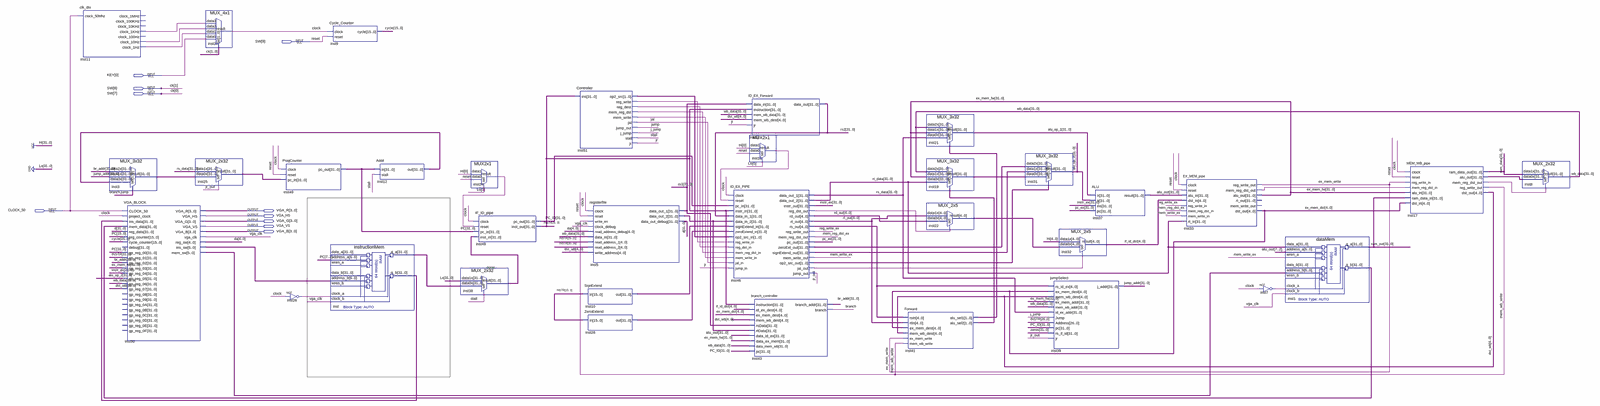
[diagram p0: schematic sheet, whole]
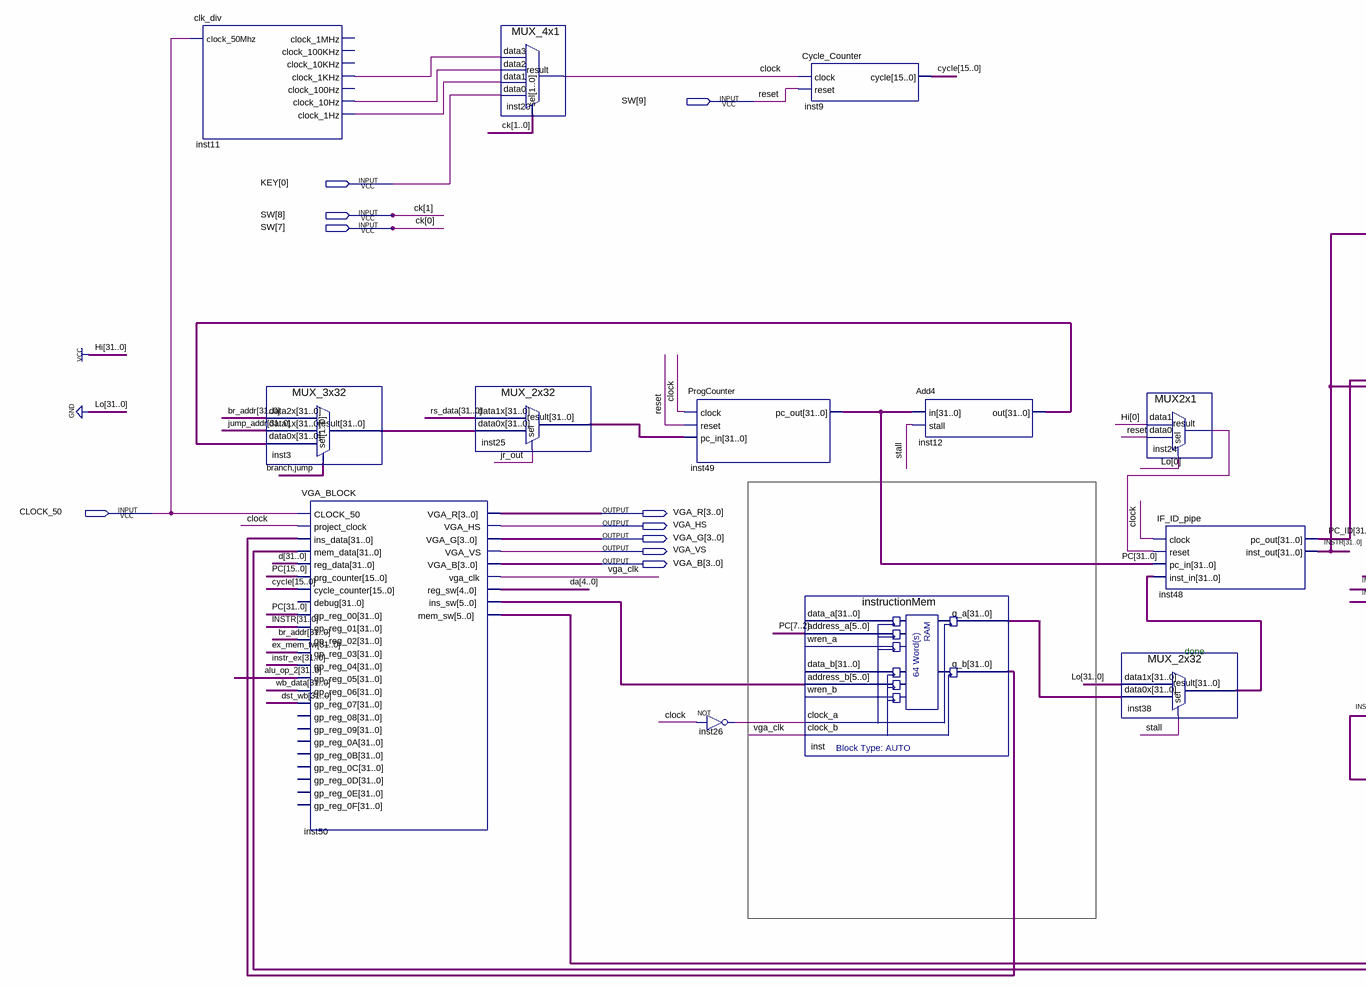
[diagram p1: schematic sheet, left part]
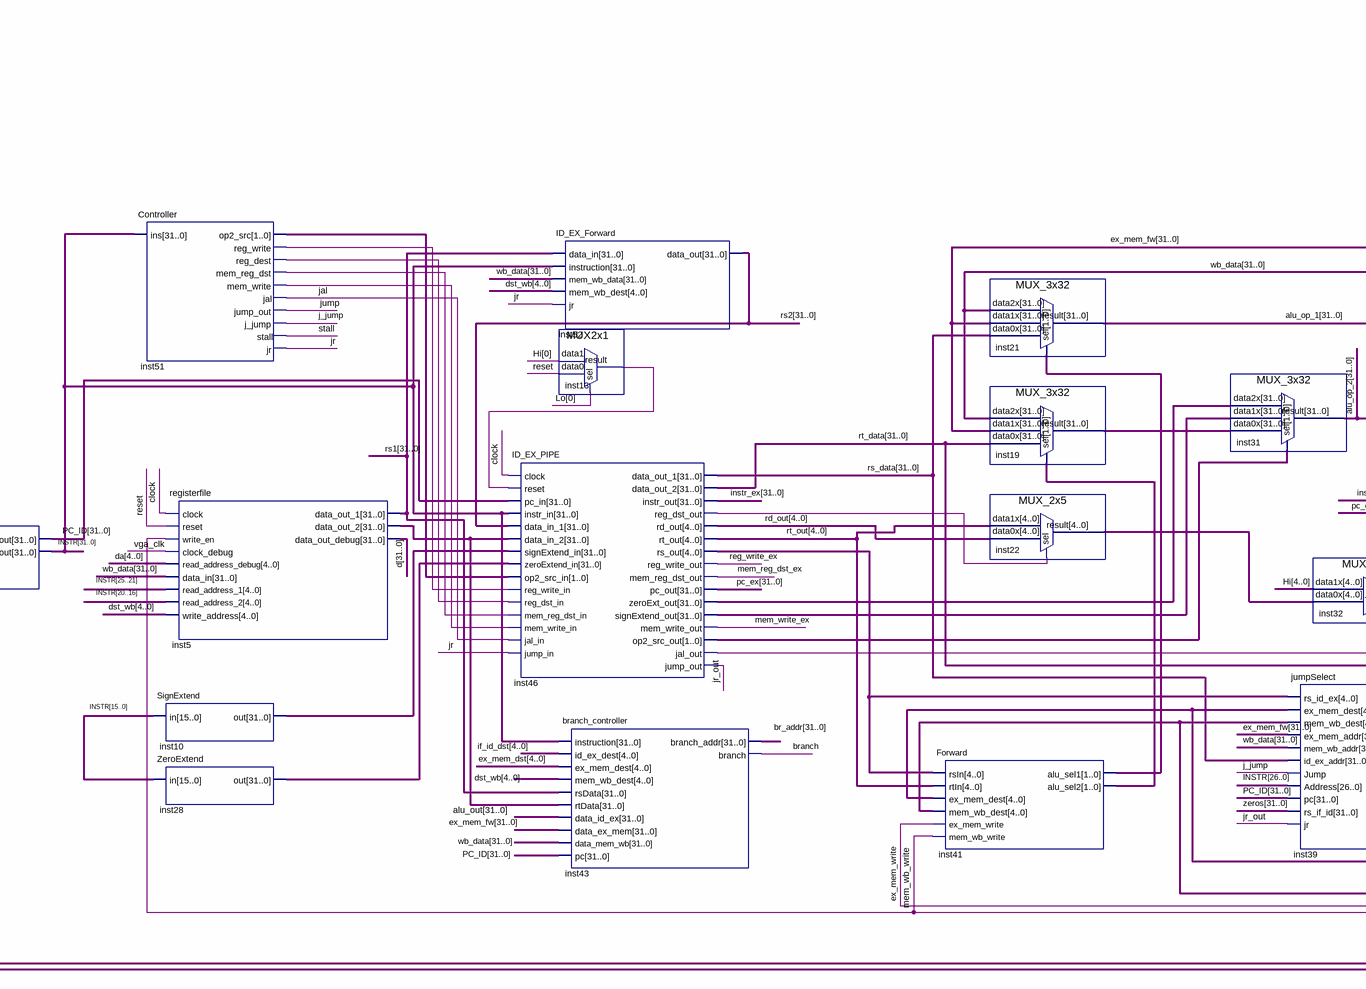
[diagram p2: schematic sheet, centre part]
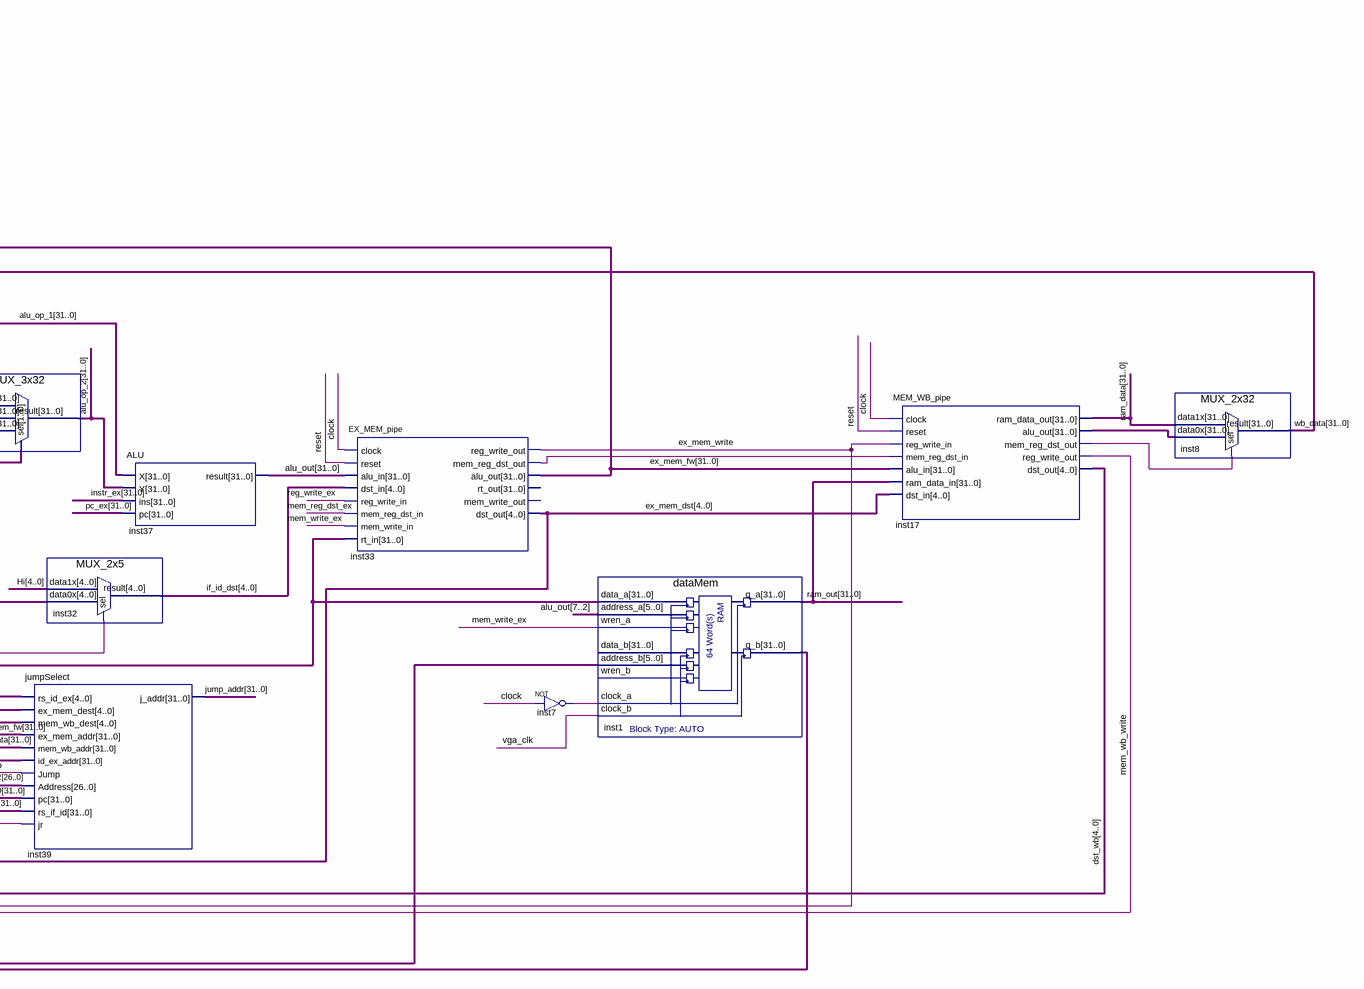
[diagram p3: schematic sheet, right part]
// Quartus schematic BetterMILESTONE4.bdf as structural Verilog: 34 symbols, 10 pins
module BetterMILESTONE4 (
  input  [9:7] SW,
  input  [0:0] KEY,
  input  CLOCK_50,
  output [3:0] VGA_R,
  output VGA_HS,
  output [3:0] VGA_G,
  output VGA_VS,
  output [3:0] VGA_B
);

  wire branch, clock, ex_mem_write, inst7_out, inst11_clock_1hz, inst11_clock_1khz, inst11_clock_10hz,
       inst13_result, inst17_mem_reg_dst_out, inst24_result, inst26_out, inst33_mem_reg_dst_out,
       inst46_jal_out, inst46_reg_dst_out, inst51_mem_reg_dst, inst51_mem_write, inst51_reg_dest,
       inst51_reg_write, j_jump, jal, jr, jr_out, jump, mem_reg_dst_ex, mem_wb_write, mem_write_ex,
       reg_write_ex, stall, vga_clk;
  wire [1:0] inst41_alu_sel1, inst41_alu_sel2, inst46_op2_src_out, inst51_op2_src;
  wire [4:0] da, ex_mem_dst, if_id_dst, inst22_result, inst46_rs_out, rd_out, rt_out;
  wire [5:0] inst50_ins_sw, inst50_mem_sw;
  wire [15:0] cycle;
  wire [31:0] alu_op_1, alu_op_2, alu_out, br_addr, d, dst_wb, ex_mem_fw, inst1_q_b, inst3_result,
       inst5_data_out_2, inst10_out, inst12_out, inst17_alu_out, inst19_result, inst25_result, inst28_out,
       inst38_result, inst46_signextend_out, inst46_zeroext_out, inst_q_a, inst_q_b, INSTR, instr_ex,
       jump_addr, PC, pc_ex, PC_ID, ram_data, ram_out, rs1, rs2, rs_data, rt_data, wb_data, zeros;

  clk_div inst11 (
    .clock_50Mhz(CLOCK_50), .clock_1KHz(inst11_clock_1khz), .clock_10Hz(inst11_clock_10hz),
    .clock_1Hz(inst11_clock_1hz));  // open: clock_1MHz, clock_100KHz, clock_10KHz, clock_100Hz
  MUX_3x32 inst3 (
    .data2x(br_addr), .data1x(jump_addr), .data0x(inst12_out), .sel({branch, jump}), .result(inst3_result));
  VGA_BLOCK inst50 (
    .CLOCK_50(CLOCK_50), .project_clock(clock), .ins_data(inst_q_b), .mem_data(inst1_q_b), .reg_data(d),
    .prg_counter(PC[15:0]), .cycle_counter(cycle), .gp_reg_00(PC), .gp_reg_01(INSTR), .gp_reg_02(br_addr),
    .gp_reg_03(ex_mem_fw), .gp_reg_04(instr_ex), .gp_reg_05(alu_op_2), .gp_reg_06(wb_data),
    .gp_reg_07(dst_wb), .VGA_R(VGA_R), .VGA_HS(VGA_HS), .VGA_G(VGA_G), .VGA_VS(VGA_VS), .VGA_B(VGA_B),
    .vga_clk(vga_clk), .reg_sw(da), .ins_sw(inst50_ins_sw), .mem_sw(inst50_mem_sw));  // open: debug, gp_reg_08, gp_reg_09, gp_reg_0A, gp_reg_0B, gp_reg_0C, gp_reg_0D, gp_reg_0E, gp_reg_0F
  MUX_4x1 inst20 (
    .data3(inst11_clock_1khz), .data2(inst11_clock_10hz), .data1(inst11_clock_1hz), .data0(KEY[0]),
    .sel(SW[8:7]), .result(clock));
  MUX_2x32 inst25 (.data1x(rs_data), .data0x(inst3_result), .sel(jr_out), .result(inst25_result));
  ProgCounter inst49 (.clock(clock), .reset(SW[9]), .pc_in(inst25_result), .pc_out(PC));
  not inst26 (inst26_out, clock);
  Cycle_Counter inst9 (.clock(clock), .reset(SW[9]), .cycle(cycle));
  instructionMem inst (
    .address_a(PC[7:2]), .address_b(inst50_ins_sw), .clock_a(inst26_out), .clock_b(vga_clk), .q_a(inst_q_a),
    .q_b(inst_q_b));  // open: data_a, wren_a, data_b, wren_b
  Add4 inst12 (.in(PC), .stall(stall), .out(inst12_out));
  MUX_2x32 inst38 (.data1x({32{1'b0}}), .data0x(inst_q_a), .sel(stall), .result(inst38_result));
  MUX2x1 inst24 (.data1(1'b1), .data0(SW[9]), .sel(1'b0), .result(inst24_result));
  IF_ID_pipe inst48 (
    .clock(clock), .reset(inst24_result), .pc_in(PC), .inst_in(inst38_result), .pc_out(PC_ID),
    .inst_out(INSTR));
  Controller inst51 (
    .ins(INSTR), .op2_src(inst51_op2_src), .reg_write(inst51_reg_write), .reg_dest(inst51_reg_dest),
    .mem_reg_dst(inst51_mem_reg_dst), .mem_write(inst51_mem_write), .jal(jal), .jump_out(jump),
    .j_jump(j_jump), .stall(stall), .jr(jr));
  SignExtend inst10 (.in(INSTR[15:0]), .out(inst10_out));
  ZeroExtend inst28 (.in(INSTR[15:0]), .out(inst28_out));
  registerfile inst5 (
    .clock(clock), .reset(SW[9]), .write_en(mem_wb_write), .clock_debug(vga_clk), .read_address_debug(da),
    .data_in(wb_data), .read_address_1(INSTR[25:21]), .read_address_2(INSTR[20:16]),
    .write_address(dst_wb[4:0]), .data_out_1(rs1), .data_out_2(inst5_data_out_2), .data_out_debug(d));
  ID_EX_PIPE inst46 (
    .clock(clock), .reset(inst13_result), .pc_in(PC_ID), .instr_in(INSTR), .data_in_1(rs2),
    .data_in_2(inst5_data_out_2), .signExtend_in(inst10_out), .zeroExtend_in(inst28_out),
    .op2_src_in(inst51_op2_src), .reg_write_in(inst51_reg_write), .reg_dst_in(inst51_reg_dest),
    .mem_reg_dst_in(inst51_mem_reg_dst), .mem_write_in(inst51_mem_write), .jal_in(jal), .jump_in(jr),
    .data_out_1(rs_data), .data_out_2(rt_data), .instr_out(instr_ex), .reg_dst_out(inst46_reg_dst_out),
    .rd_out(rd_out), .rt_out(rt_out), .rs_out(inst46_rs_out), .reg_write_out(reg_write_ex),
    .mem_reg_dst_out(mem_reg_dst_ex), .pc_out(pc_ex), .zeroExt_out(inst46_zeroext_out),
    .signExtend_out(inst46_signextend_out), .mem_write_out(mem_write_ex), .op2_src_out(inst46_op2_src_out),
    .jal_out(inst46_jal_out), .jump_out(jr_out));
  ID_EX_Forward inst52 (
    .data_in(rs1), .instruction(INSTR), .mem_wb_data(wb_data), .mem_wb_dest(dst_wb[4:0]), .jr(jr),
    .data_out(rs2));
  MUX2x1 inst13 (.data1(1'b1), .data0(SW[9]), .sel(1'b0), .result(inst13_result));
  branch_controller inst43 (
    .instruction(INSTR), .id_ex_dest(if_id_dst), .ex_mem_dest(ex_mem_dst), .mem_wb_dest(dst_wb[4:0]),
    .rsData(rs1), .rtData(inst5_data_out_2), .data_id_ex(alu_out), .data_ex_mem(ex_mem_fw),
    .data_mem_wb(wb_data), .pc(PC_ID), .branch_addr(br_addr), .branch(branch));
  Forward inst41 (
    .rsIn(inst46_rs_out), .rtIn(rt_out), .ex_mem_dest(ex_mem_dst), .mem_wb_dest(dst_wb[4:0]),
    .ex_mem_write(ex_mem_write), .mem_wb_write(mem_wb_write), .alu_sel1(inst41_alu_sel1),
    .alu_sel2(inst41_alu_sel2));
  MUX_3x32 inst21 (.data2x(wb_data), .data1x(ex_mem_fw), .data0x(rs_data), .sel(inst41_alu_sel1), .result(alu_op_1));
  MUX_3x32 inst19 (
    .data2x(wb_data), .data1x(ex_mem_fw), .data0x(rt_data), .sel(inst41_alu_sel2), .result(inst19_result));
  MUX_2x5 inst22 (.data1x(rt_out), .data0x(rd_out), .sel(inst46_reg_dst_out), .result(inst22_result));
  MUX_3x32 inst31 (
    .data2x(inst46_zeroext_out), .data1x(inst46_signextend_out), .data0x(inst19_result),
    .sel(inst46_op2_src_out), .result(alu_op_2));
  MUX_2x5 inst32 (.data1x({5{1'b1}}), .data0x(inst22_result), .sel(inst46_jal_out), .result(if_id_dst));
  jumpSelect inst39 (
    .rs_id_ex(inst46_rs_out), .ex_mem_dest(ex_mem_dst), .mem_wb_dest(dst_wb[4:0]), .ex_mem_addr(ex_mem_fw),
    .mem_wb_addr(wb_data), .id_ex_addr(rs_data), .Jump(j_jump), .Address(INSTR[26:0]), .pc(PC_ID),
    .rs_if_id(zeros), .jr(jr_out), .j_addr(jump_addr));
  ALU inst37 (.X(alu_op_1), .Y(alu_op_2), .ins(instr_ex), .pc(pc_ex), .result(alu_out));
  EX_MEM_pipe inst33 (
    .clock(clock), .reset(SW[9]), .alu_in(alu_out), .dst_in(if_id_dst), .reg_write_in(reg_write_ex),
    .mem_reg_dst_in(mem_reg_dst_ex), .mem_write_in(mem_write_ex), .rt_in(rt_data),
    .reg_write_out(ex_mem_write), .mem_reg_dst_out(inst33_mem_reg_dst_out), .alu_out(ex_mem_fw),
    .dst_out(ex_mem_dst));  // open: rt_out, mem_write_out
  not inst7 (inst7_out, clock);
  dataMem inst1 (
    .data_a(rt_data), .address_a(alu_out[7:2]), .wren_a(mem_write_ex), .address_b(inst50_mem_sw),
    .clock_a(inst7_out), .clock_b(vga_clk), .q_a(ram_out), .q_b(inst1_q_b));  // open: data_b, wren_b
  MEM_WB_pipe inst17 (
    .clock(clock), .reset(SW[9]), .reg_write_in(ex_mem_write), .mem_reg_dst_in(inst33_mem_reg_dst_out),
    .alu_in(ex_mem_fw), .ram_data_in(ram_out), .dst_in(ex_mem_dst), .ram_data_out(ram_data),
    .alu_out(inst17_alu_out), .mem_reg_dst_out(inst17_mem_reg_dst_out), .reg_write_out(mem_wb_write),
    .dst_out(dst_wb[4:0]));
  MUX_2x32 inst8 (.data1x(ram_data), .data0x(inst17_alu_out), .sel(inst17_mem_reg_dst_out), .result(wb_data));

  // Other names for the same wires on the sheet: reset = SW[9]; ck[1:0] = SW[8:7]

  // Notes on the sheet:
  //   done
endmodule
